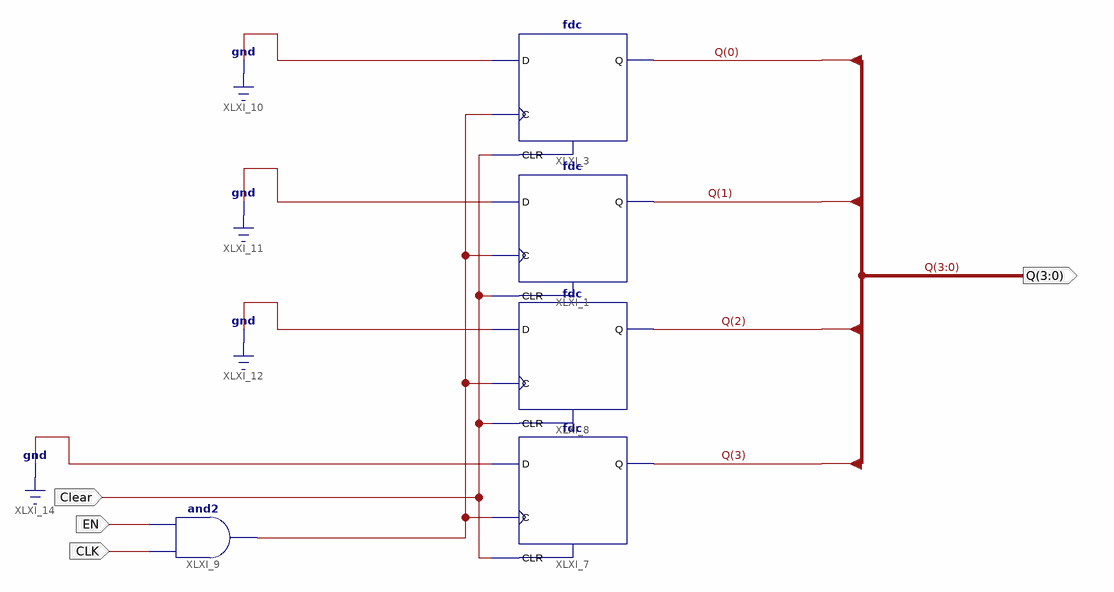
[diagram p0: schematic sheet 1]
// Xilinx ISE schematic Four_bit_zero_reg.sch (spartan3e) as structural Verilog: 5 symbols, 4 ports
module Four_bit_zero_reg (
  input  CLK,
  input  EN,
  input  Clear,
  output [3:0] Q
);

  wire XLXN_11;

  and XLXI_9 (XLXN_11, CLK, EN);
  fdc XLXI_3 (.C(XLXN_11), .CLR(Clear), .D(1'b0), .Q(Q[0]));
  fdc XLXI_7 (.C(XLXN_11), .CLR(Clear), .D(1'b0), .Q(Q[3]));
  fdc XLXI_8 (.C(XLXN_11), .CLR(Clear), .D(1'b0), .Q(Q[2]));
  fdc XLXI_1 (.C(XLXN_11), .CLR(Clear), .D(1'b0), .Q(Q[1]));
endmodule
